# EAGLE design SparkFun_RFM22_SHield (EAGLE 7.2.0)
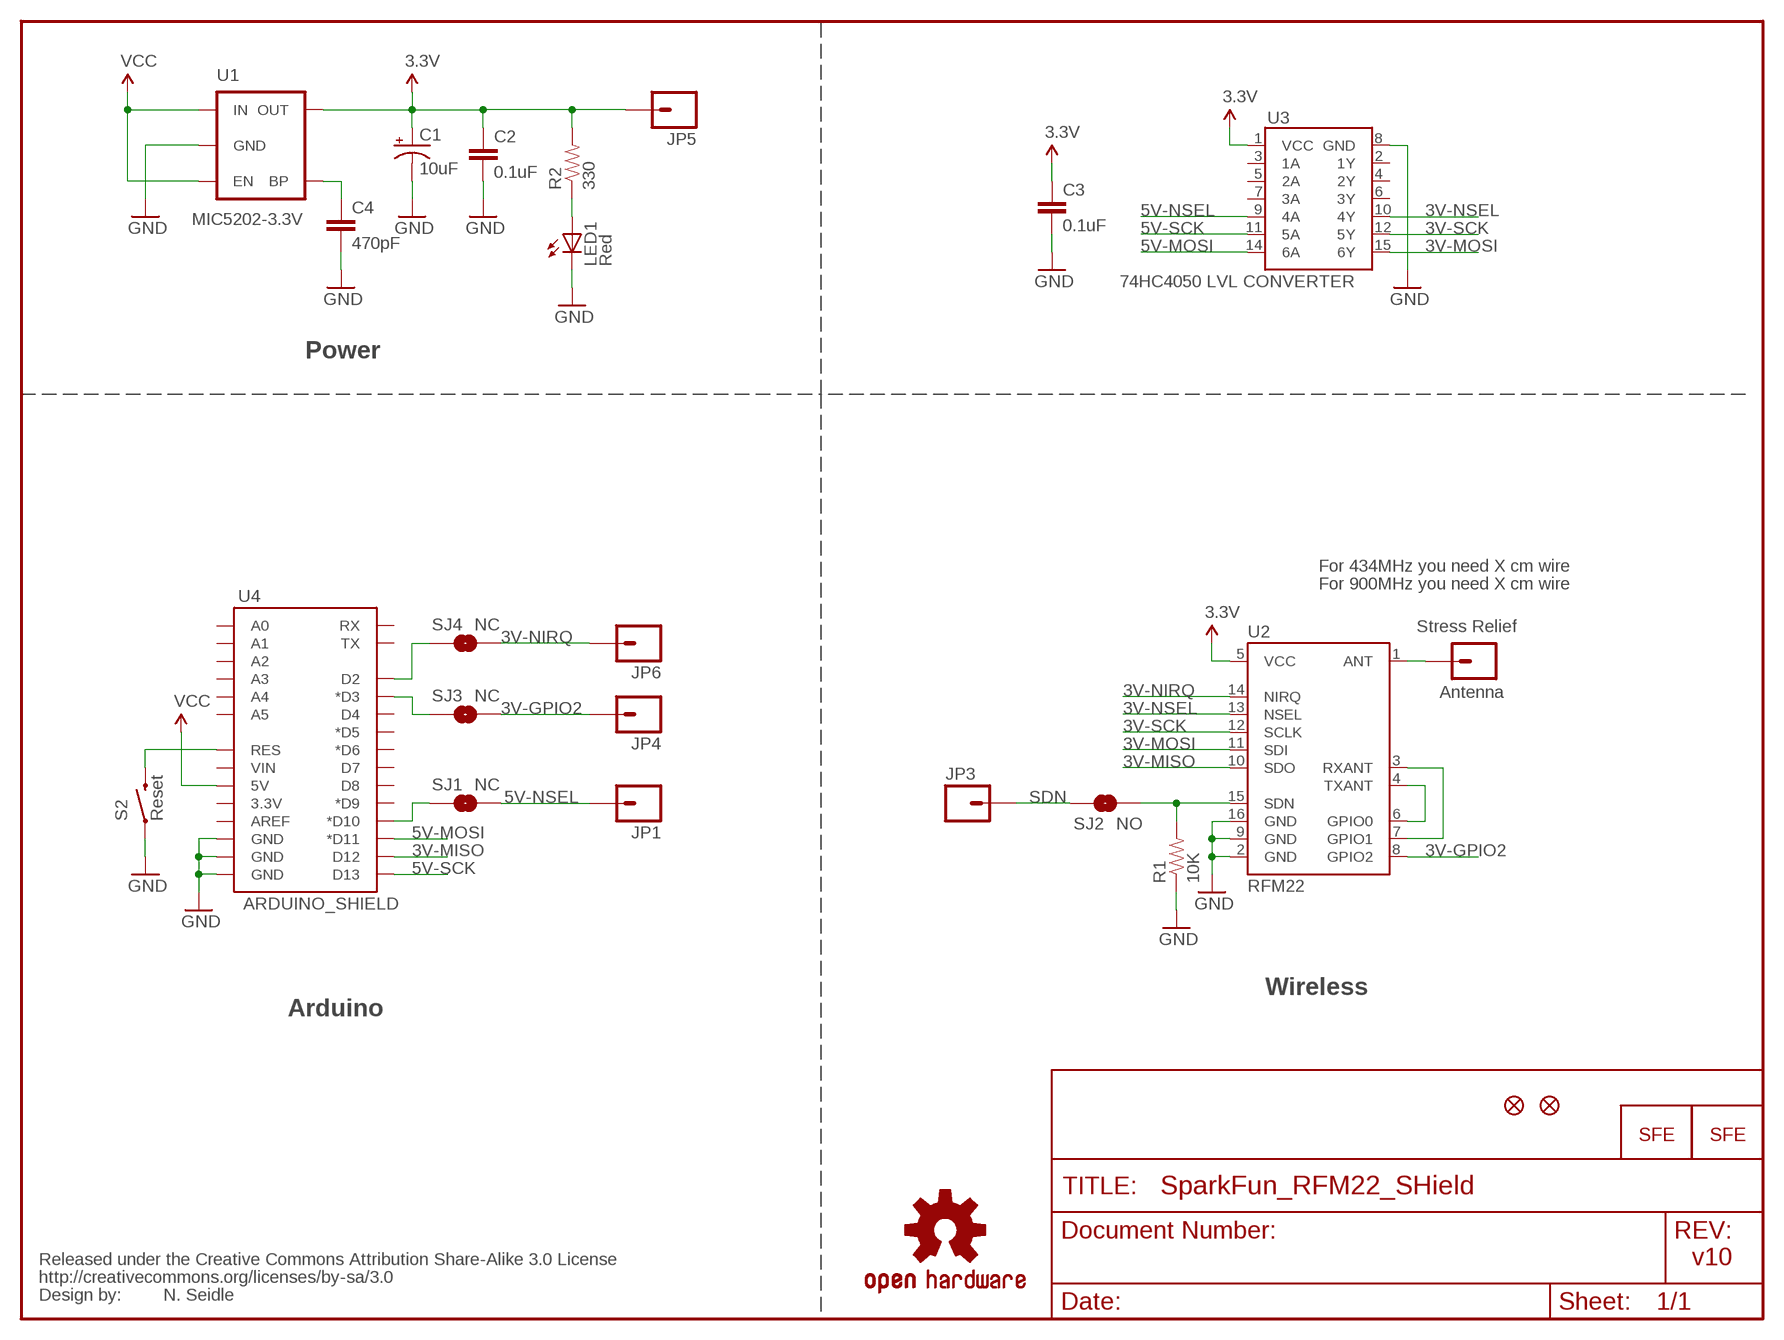
[diagram p0: schematic, sheet 1]

## Parts
C1  10uF  CAP_POL1206  [EIA3216]
C2  0.1uF  CAP0402-CAP  [0402-CAP]
C3  0.1uF  CAP0402-CAP  [0402-CAP]
C4  470pF  CAP0402-CAP  [0402-CAP]
JP1  M01PTH  [1X01]
JP2  Antenna  M01PTH  [1X01]
JP3  M01PTH  [1X01]
JP4  M01PTH  [1X01]
JP5  M01PTH  [1X01]
JP6  M01PTH  [1X01]
JP7  FIDUCIALUFIDUCIAL  [MICRO-FIDUCIAL]
JP8  FIDUCIALUFIDUCIAL  [MICRO-FIDUCIAL]
LED1  Red  LED0603  [LED-0603]
R1  10K  RESISTOR0402-RES  [0402-RES]
R2  330  RESISTOR0402-RES  [0402-RES]
S2  Reset  SWITCH-MOMENTARY-2SMD  [TACTILE_SWITCH_SMD]
SJ1  NC  SOLDERJUMPERTRACE  [SJ_2S-TRACE]
SJ2  NO  SOLDERJUMPERNO  [SJ_2S-NO]
SJ3  NC  SOLDERJUMPERTRACE  [SJ_2S-TRACE]
SJ4  NC  SOLDERJUMPERTRACE  [SJ_2S-TRACE]
U1  MIC5202-3.3V  V_REG_LDOSMD  [SOT23-5]
U2  RFM22  RFM22SMD  [RFM22-XXX-S2]
U3  74HC4050 LVL CONVERTER  HEX_CONVERTER  [SO016]
U4  ARDUINO_SHIELD  ARDUINO_SHIELDNOHOLES  [DUEMILANOVE_SHIELD_NOHOLES]
U$1  OSHW-LOGOS  [OSHW-LOGO-S]
U$3  CREATIVE_COMMONS  [CREATIVE_COMMONS]
U$7  LOGO-SFENEW  [SFE-NEW-WEBLOGO]
U$8  LOGO-SFENEW  [SFE-NEW-WEBLOGO]

## Nets
3.3V: C1.A(+) C2.1 C3.1 JP5.1 R2.2 U1.5(OUT) U2.5(VCC) U3.1(VCC)
3V-GPIO2: JP4.1 SJ3.2 U2.8(GPIO2)
3V-MISO: U2.10(SDO) U4.D12
3V-MOSI: U2.11(SDI) U3.15(6Y)
3V-NIRQ: JP6.1 SJ4.2 U2.14(NIRQ)
3V-NSEL: U2.13(NSEL) U3.10(4Y)
3V-SCK: U2.12(SCLK) U3.12(5Y)
5V-MOSI: U3.14(6A) U4.D11(*D11)
5V-NSEL: JP1.1 SJ1.2 U3.9(4A)
5V-SCK: U3.11(5A) U4.D13
ARST: S2.3 U4.RES
GND: C1.C(-) C2.2 C3.2 C4.2 LED1.C R1.1 S2.1 U1.2(GND) U2.2(GND) U2.9(GND) U2.16(GND) U3.8(GND) U4.GND@0(GND) U4.GND@1(GND) U4.GND@2(GND)
N$1: JP2.1 U2.1(ANT)
N$2: SJ1.1 U4.D10(*D10)
N$3: U2.4(TXANT) U2.6(GPIO0)
N$4: U2.3(RXANT) U2.7(GPIO1)
N$5: SJ3.1 U4.D3(*D3)
N$6: LED1.A R2.1
N$17: SJ4.1 U4.D2
N$70: C4.1 U1.4(BP)
SDN: JP3.1 SJ2.1
SDN2: R1.2 SJ2.2 U2.15(SDN)
VCC: U1.1(IN) U1.3(EN) U4.5V
Unconnected: U3.2(1Y) U3.3(1A) U3.4(2Y) U3.5(2A) U3.6(3Y) U3.7(3A) U4.3.3V U4.A0 U4.A1 U4.A2 U4.A3 U4.A4 U4.A5 U4.AREF U4.D4 U4.D5(*D5) U4.D6(*D6) U4.D7 U4.D8 U4.D9(*D9) U4.RX U4.TX U4.VIN

## Notes on the sheet
- Power
- For 434MHz you need X cm wire
- For 900MHz you need X cm wire
- Stress Relief
- Wireless
- Arduino
- v10
- N. Seidle

## Library data of the parts
C1 = SparkFun:CAP_POL: Capacitor Polarized These are standard SMD and PTH capacitors. Normally 10uF, 47uF, and 100uF in electrolytic and tantalum varieties. Always verify the external diameter of the through hole cap, it varies with capacity, voltage, and manufacturer. The EIA devices should be standard.
C2-C4 = SparkFun:CAP: Capacitor Standard 0603 ceramic capacitor, and 0.1" leaded capacitor.
JP1-JP6 = SparkFun:M01: Header 1 Standard 1-pin 0.1" header. Use with straight break away headers (SKU : PRT-00116), right angle break away headers (PRT-00553), swiss pins (PRT-00743), machine pins (PRT-00117), and female headers (PRT-00115).
JP7 JP8 = SparkFun:FIDUCIAL: Fiducial Alignment Points Various fiducial points for machine vision alignment.
LED1 = SparkFun:LED: LEDs Standard schematic elements and footprints for 5mm, 3mm, 1206, and 0603 sized LEDs. 5mm - Spark Fun Electronics SKU : COM-00529 (and others)
R1 R2 = SparkFun:RESISTOR: Resistor Basic schematic elements and footprints for 0603, 1206, and PTH resistors.
S2 = SparkFun:SWITCH-MOMENTARY-2
SJ1-SJ4 = SparkFun:SOLDERJUMPER: Solder Jumper Standard SMD solder jumper. Used to automate production. Two varients : Normally Open and Normally Closed are the same, but have different paste layers. NC will have a large amount of paste and should jumper during reflow.
U1 = SparkFun:V_REG_LDO: Voltage Regulator LDO Standard 150mA LDO voltage regulator in SOT-23 layout. Micrel part MIC5205. BP (by-pass) pin is used to lower output noise with 470pF cap.
U2 = SparkFun:RFM22: Description: The RFM22 is a low-power, low cost radio that is capable of operating in the 434MHz and 900MHz open bands. It's frequency is software defined and there are some very good libraries written for it.
U3 = SparkFun:HEX_CONVERTER
U4 = SparkFun:ARDUINO_SHIELD
U$1 = SparkFun:OSHW-LOGO: Open Source Hardware Logo This logo indicates the piece of hardware it is found on incorporates a OSHW license and/or adheres to the definition of open source hardware found here: http://freedomdefined.org/OSHW
U$3 = SparkFun:CREATIVE_COMMONS
U$7 U$8 = SparkFun:LOGO-SFE: Spark Fun Electronics PCB Logo This is the standard Spark Fun Electronics PCB logo.

## Board
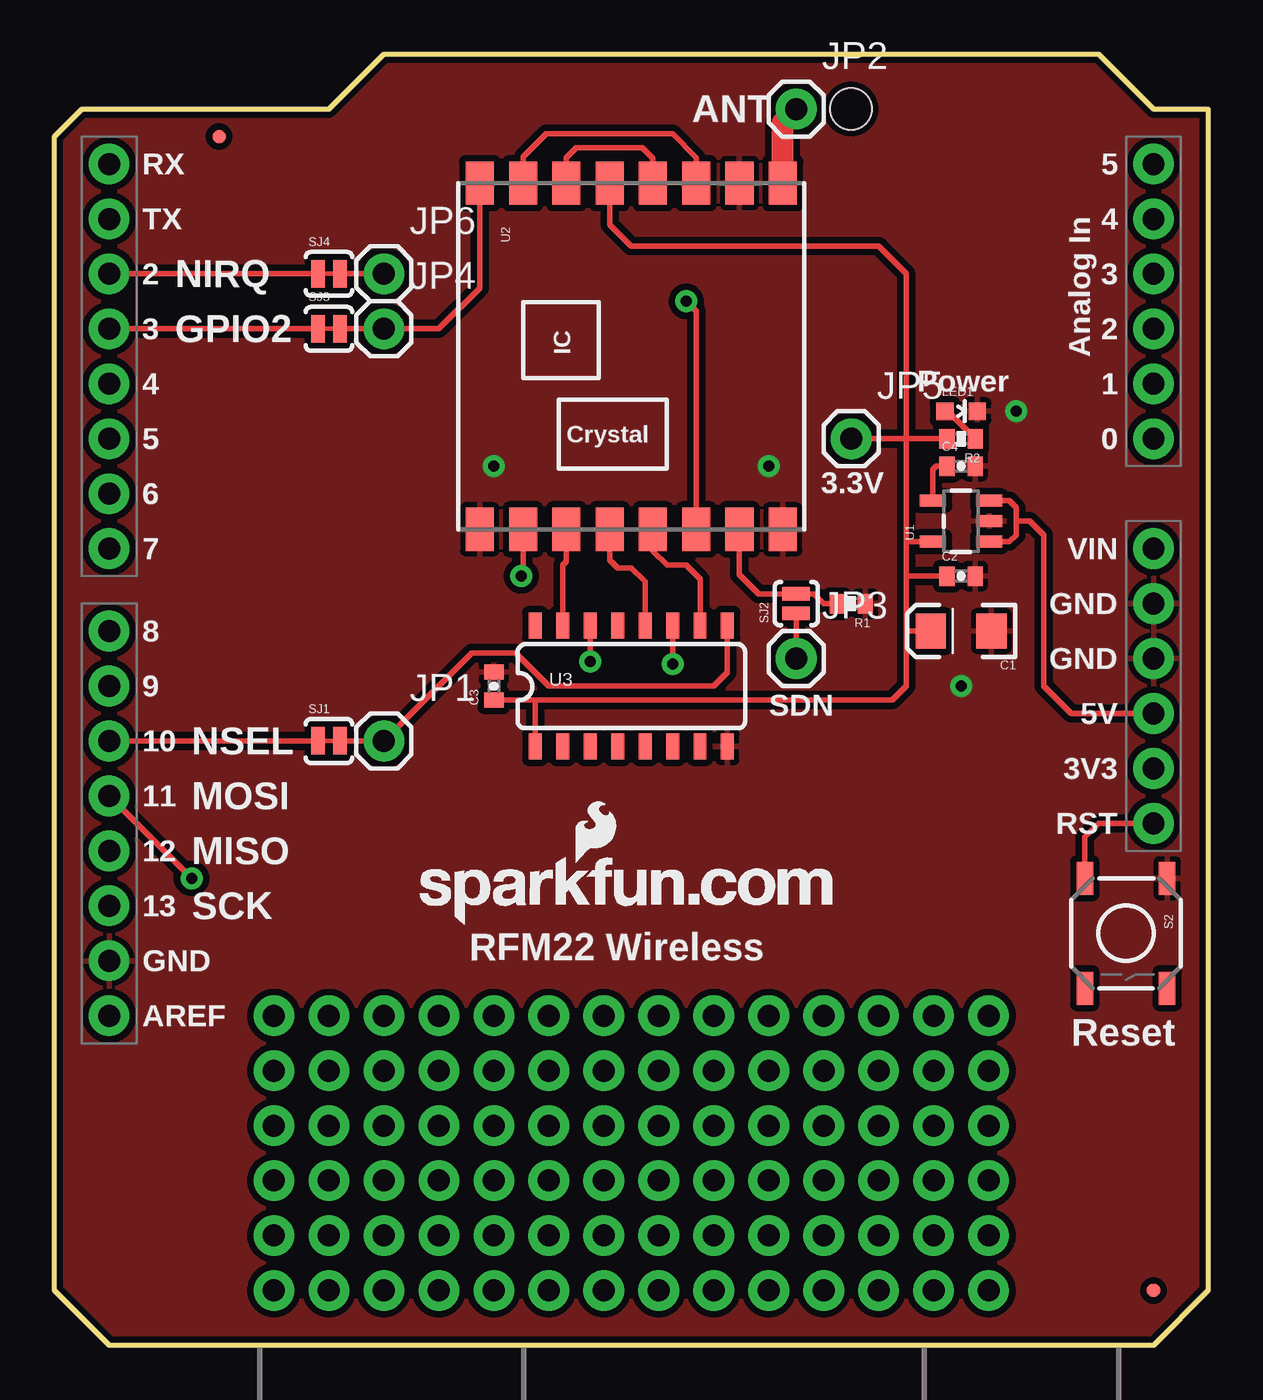
[diagram p1: board, top side]
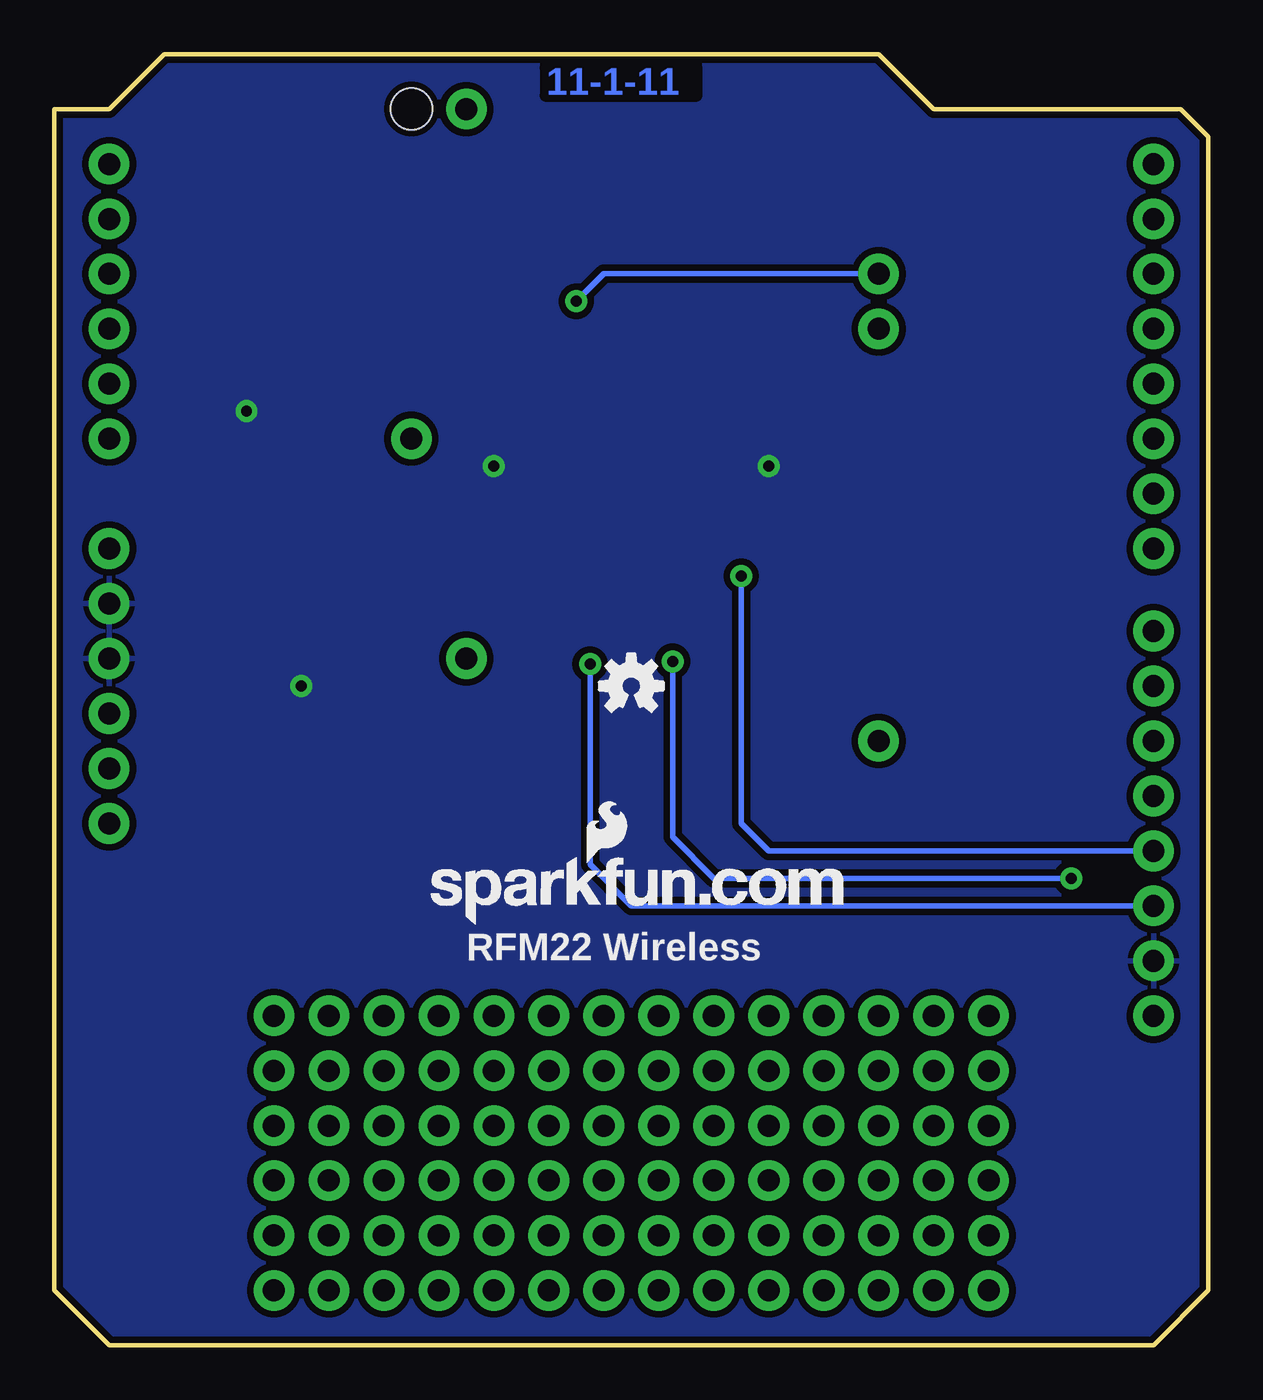
[diagram p2: board, bottom side, seen from below]

Size 53.34 x 59.69 mm. Coordinates in mm from the lower left corner, seen from the top.
Outline: 0,55.88 1.27,57.15 12.7,57.15 15.24,59.69 48.26,59.69 50.8,57.15 53.34,57.15 53.34,2.54 50.8,0 2.54,0 0,2.54 0,55.88
Copper layers (1*16): Top 0.035mm / dielectric 1.5mm / Bottom 0.035mm
Design rules "default": minimum track width 8mil, minimum drill 20mil, track to track 8mil, track to pad 8mil, pad to pad 8mil, via to via 8mil, smd to smd 8mil, copper to edge 10mil, drill to drill 8mil, minimum pad ring 12mil, minimum via ring 10mil, stop-mask expansion 4mil, vias tented up to drill 20mil, thermal gap 10mil
Holes 1.91 mm at 36.83,57.15

### Footprints (pad centres in the part's own frame; a part is rotated, then mirrored left to right if it is on the bottom)
EIA3216 = smd 1.4 x 1.6: A 1.4,0; C -1.4,0
0402-CAP = smd 0.7 x 0.9: 1 -0.65,0; 2 0.65,0
1X01 = drill 1.016 pad 1.88: 1 0,0
MICRO-FIDUCIAL = smd 0.635 x 0.635: 1 0,0
LED-0603 = smd 0.8 x 0.8: A 0,-0.75; C 0,0.75
0402-RES = smd 0.7 x 0.9: 1 -0.65,0; 2 0.65,0
TACTILE_SWITCH_SMD = smd 1.524 x 0.762: 1 -2.54,1.905; 2 2.54,1.905; 3 -2.54,-1.905; 4 2.54,-1.905
SJ_2S-TRACE = smd 0.635 x 1.27: 1 -0.508,0; 2 0.508,0
SJ_2S-NO = smd 0.635 x 1.27: 1 -0.45,0; 2 0.45,0
SOT23-5 = smd 0.55 x 1.2: 1 -0.95,-1.3; 2 0,-1.3; 3 0.95,-1.3; 4 0.95,1.3; 5 -0.95,1.3
RFM22-XXX-S2 = smd 2 x 1.3: 1 -8,7; 2 -8,5; 3 -8,3; 4 -8,1; 5 -8,-1; 6 -8,-3; 7 -8,-5; 8 -8,-7; 9 8,-7; 10 8,-5; 11 8,-3; 12 8,-1; 13 8,1; 14 8,3; 15 8,5; 16 8,7
SO016 = smd 0.6 x 1.2: 1 -4.445,-2.8; 2 -3.175,-2.8; 3 -1.905,-2.8; 4 -0.635,-2.8; 5 0.635,-2.8; 6 1.905,-2.8; 7 3.175,-2.8; 8 4.445,-2.8; 9 4.445,2.8; 10 3.175,2.8; 11 1.905,2.8; 12 0.635,2.8; 13 -0.635,2.8; 14 -1.905,2.8; 15 -3.175,2.8; 16 -4.445,2.8
DUEMILANOVE_SHIELD_NOHOLES = drill 1.016 pad 1.88: 3.3V 50.8,26.67; 5V 50.8,29.21; A0 50.8,41.91; A1 50.8,44.45; A2 50.8,46.99; A3 50.8,49.53; A4 50.8,52.07; A5 50.8,54.61; AREF 2.54,15.24; D2 2.54,49.53; D3 2.54,46.99; D4 2.54,44.45; D5 2.54,41.91; D6 2.54,39.37; D7 2.54,36.83; D8 2.54,33.02; D9 2.54,30.48; D10 2.54,27.94; D11 2.54,25.4; D12 2.54,22.86; D13 2.54,20.32; GND@0 50.8,31.75; GND@1 50.8,34.29; GND@2 2.54,17.78; RES 50.8,24.13; RX 2.54,54.61; TX 2.54,52.07; VIN 50.8,36.83

### Placement (x,y rotation side)
C1  41.91,33.02 180 top
C2  41.91,35.56 0 top
C3  20.32,30.48 90 top
C4  41.91,40.64 0 top
JP1  15.24,27.94 0 top
JP2  34.29,57.15 0 top
JP3  34.29,31.75 0 top
JP4  15.24,46.99 0 top
JP5  36.83,41.91 0 top
JP6  15.24,49.53 0 top
JP7  50.8,2.54 0 top
JP8  7.62,55.88 0 top
LED1  41.91,43.18 270 top
R1  36.83,34.29 180 top
R2  41.91,41.91 180 top
S2  49.53,19.05 270 top
SJ1  12.7,27.94 0 top
SJ2  34.29,34.29 90 top
SJ3  12.7,46.99 0 top
SJ4  12.7,49.53 0 top
U1  41.91,38.1 90 top
U2  26.67,45.72 270 top
U3  26.67,30.48 0 top
U4  0,0 0 top
U$1  26.67,30.48 0 bottom
U$3  -19.05,-11.43 0 top  (outside the outline)
U$7  16.89,19.43 0 top
U$8  35.94,19.43 0 bottom

### Tracks (layer width: path | path; a pad name or v marks a point on that pad's centre or on a via)
3.3V
  Top 0.254: 39.37,33.02 39.37,35.56 | 39.37,35.56 39.37,37.21 | 39.37,33.02 C1.A | 39.37,35.56 C2.1 | U1.5 39.43,37.15 39.37,37.21 | 22.23,29.83 C3.1 | 22.23,29.83 38.72,29.83 39.37,30.48 39.37,33.02 | U3.1 22.23,29.83 | U2.5 25.67,51.8 26.67,50.8 38.1,50.8 39.37,49.53 39.37,41.91 | 39.37,37.21 39.37,41.91 | 39.37,41.91 R2.2 | 39.37,41.91 JP5.1
3V-GPIO2
  Top 0.254: U2.8 19.67,48.88 17.78,46.99 JP4.1 SJ3.2
3V-MISO  (via drill 0.51)
  Top 0.254: U2.10 21.67,35.64 v21.59,35.56
  Bottom 0.254: U4.D12 20.32,22.86 21.59,24.13 v21.59,35.56
3V-MOSI
  Top 0.254: U3.15 23.5,36.07 23.67,36.24 U2.11
3V-NIRQ  (via drill 0.51)
  Top 0.254: U2.14 29.67,47.8 v29.21,48.26 | SJ4.2 JP6.1
  Bottom 0.254: v29.21,48.26 27.94,49.53 JP6.1
3V-NSEL
  Top 0.254: U2.13 27.67,36.72 28.32,36.07 29.21,36.07 29.84,35.43 U3.10
3V-SCK
  Top 0.254: U2.12 25.67,36.31 26.04,35.94 26.67,35.94 27.3,35.31 U3.12
5V-MOSI  (via drill 0.51)
  Top 0.254: v24.77,31.62 U3.14 | v6.35,21.59 U4.D11
  Bottom 0.254: v24.77,31.62 24.77,23.5 22.86,21.59 v6.35,21.59
5V-NSEL
  Top 0.254: SJ1.2 JP1.1 19.3,32 21.34,32 22.86,30.48 30.48,30.48 31.11,31.11 U3.9
5V-SCK  (via drill 0.51)
  Top 0.254: v28.57,31.5 U3.11
  Bottom 0.254: U4.D13 26.67,20.32 28.57,22.23 v28.57,31.5
ARST
  Top 0.254: S2.3 47.62,23.5 48.26,24.13 U4.RES
GND  (via drill 0.51 pad 1.02)
  other vias: 20.32,40.64 33.02,40.64 41.91,30.48 44.45,43.18
  pour Top (isolate 0.305): 0,59.69 53.34,59.69 53.34,0 0,0
  pour Bottom (isolate 0.305): 0,0 0,59.69 53.34,59.69 53.34,0
N$1
  Top 1.016: U2.1 33.67,56.53 JP2.1
N$2
  Top 0.254: U4.D10 SJ1.1
N$3
  Top 0.254: U2.4 27.67,54.88 27.18,55.37 24.13,55.37 23.67,54.91 U2.6
N$4
  Top 0.254: U2.3 29.67,54.91 28.57,56.01 22.73,56.01 21.67,54.94 U2.7
N$5
  Top 0.254: U4.D3 SJ3.1
N$6
  Top 0.254: LED1.A 41.29,43.18 R2.1
N$7  (via drill 1.02 pad 1.88)
  other vias: 10.16,2.54
N$8  (via drill 1.02 pad 1.88)
  other vias: 10.16,5.08
N$9  (via drill 1.02 pad 1.88)
  other vias: 10.16,7.62
N$10  (via drill 1.02 pad 1.88)
  other vias: 12.7,2.54
N$11  (via drill 1.02 pad 1.88)
  other vias: 12.7,5.08
N$12  (via drill 1.02 pad 1.88)
  other vias: 12.7,7.62
N$13  (via drill 1.02 pad 1.88)
  other vias: 12.7,10.16
N$14  (via drill 1.02 pad 1.88)
  other vias: 10.16,10.16
N$15  (via drill 1.02 pad 1.88)
  other vias: 10.16,12.7
N$16  (via drill 1.02 pad 1.88)
  other vias: 10.16,15.24
N$17
  Top 0.254: U4.D2 SJ4.1
N$18  (via drill 1.02 pad 1.88)
  other vias: 12.7,12.7
N$19  (via drill 1.02 pad 1.88)
  other vias: 12.7,15.24
N$23  (via drill 1.02 pad 1.88)
  other vias: 15.24,2.54
N$24  (via drill 1.02 pad 1.88)
  other vias: 15.24,5.08
N$25  (via drill 1.02 pad 1.88)
  other vias: 15.24,7.62
N$26  (via drill 1.02 pad 1.88)
  other vias: 17.78,2.54
N$27  (via drill 1.02 pad 1.88)
  other vias: 17.78,5.08
N$28  (via drill 1.02 pad 1.88)
  other vias: 17.78,7.62
N$29  (via drill 1.02 pad 1.88)
  other vias: 17.78,10.16
N$30  (via drill 1.02 pad 1.88)
  other vias: 15.24,10.16
N$31  (via drill 1.02 pad 1.88)
  other vias: 20.32,2.54
N$32  (via drill 1.02 pad 1.88)
  other vias: 20.32,5.08
N$33  (via drill 1.02 pad 1.88)
  other vias: 20.32,7.62
N$34  (via drill 1.02 pad 1.88)
  other vias: 22.86,2.54
N$35  (via drill 1.02 pad 1.88)
  other vias: 22.86,5.08
N$36  (via drill 1.02 pad 1.88)
  other vias: 22.86,7.62
N$37  (via drill 1.02 pad 1.88)
  other vias: 22.86,10.16
N$38  (via drill 1.02 pad 1.88)
  other vias: 20.32,10.16
N$39  (via drill 1.02 pad 1.88)
  other vias: 25.4,2.54
N$40  (via drill 1.02 pad 1.88)
  other vias: 25.4,5.08
N$41  (via drill 1.02 pad 1.88)
  other vias: 25.4,7.62
N$42  (via drill 1.02 pad 1.88)
  other vias: 27.94,2.54
N$43  (via drill 1.02 pad 1.88)
  other vias: 27.94,5.08
N$44  (via drill 1.02 pad 1.88)
  other vias: 27.94,7.62
N$45  (via drill 1.02 pad 1.88)
  other vias: 27.94,10.16
N$46  (via drill 1.02 pad 1.88)
  other vias: 25.4,10.16
N$47  (via drill 1.02 pad 1.88)
  other vias: 30.48,2.54
N$48  (via drill 1.02 pad 1.88)
  other vias: 30.48,5.08
N$49  (via drill 1.02 pad 1.88)
  other vias: 30.48,7.62
N$50  (via drill 1.02 pad 1.88)
  other vias: 33.02,2.54
N$51  (via drill 1.02 pad 1.88)
  other vias: 33.02,5.08
N$52  (via drill 1.02 pad 1.88)
  other vias: 33.02,7.62
N$53  (via drill 1.02 pad 1.88)
  other vias: 33.02,10.16
N$54  (via drill 1.02 pad 1.88)
  other vias: 30.48,10.16
N$55  (via drill 1.02 pad 1.88)
  other vias: 35.56,2.54
N$56  (via drill 1.02 pad 1.88)
  other vias: 35.56,5.08
N$57  (via drill 1.02 pad 1.88)
  other vias: 35.56,7.62
N$58  (via drill 1.02 pad 1.88)
  other vias: 38.1,2.54
N$59  (via drill 1.02 pad 1.88)
  other vias: 38.1,5.08
N$60  (via drill 1.02 pad 1.88)
  other vias: 38.1,7.62
N$61  (via drill 1.02 pad 1.88)
  other vias: 38.1,10.16
N$62  (via drill 1.02 pad 1.88)
  other vias: 35.56,10.16
N$63  (via drill 1.02 pad 1.88)
  other vias: 40.64,2.54
N$64  (via drill 1.02 pad 1.88)
  other vias: 40.64,5.08
N$65  (via drill 1.02 pad 1.88)
  other vias: 40.64,7.62
N$66  (via drill 1.02 pad 1.88)
  other vias: 43.18,2.54
N$67  (via drill 1.02 pad 1.88)
  other vias: 43.18,5.08
N$68  (via drill 1.02 pad 1.88)
  other vias: 43.18,7.62
N$69  (via drill 1.02 pad 1.88)
  other vias: 43.18,10.16
N$70
  Top 0.254: U1.4 40.61,40.48 40.77,40.64 C4.1
N$71  (via drill 1.02 pad 1.88)
  other vias: 40.64,10.16
N$88  (via drill 1.02 pad 1.88)
  other vias: 15.24,12.7
N$89  (via drill 1.02 pad 1.88)
  other vias: 15.24,15.24
N$91  (via drill 1.02 pad 1.88)
  other vias: 17.78,12.7
N$92  (via drill 1.02 pad 1.88)
  other vias: 17.78,15.24
N$96  (via drill 1.02 pad 1.88)
  other vias: 20.32,12.7
N$97  (via drill 1.02 pad 1.88)
  other vias: 20.32,15.24
N$99  (via drill 1.02 pad 1.88)
  other vias: 22.86,12.7
N$100  (via drill 1.02 pad 1.88)
  other vias: 22.86,15.24
N$104  (via drill 1.02 pad 1.88)
  other vias: 25.4,12.7
N$105  (via drill 1.02 pad 1.88)
  other vias: 25.4,15.24
N$107  (via drill 1.02 pad 1.88)
  other vias: 27.94,12.7
N$108  (via drill 1.02 pad 1.88)
  other vias: 27.94,15.24
N$112  (via drill 1.02 pad 1.88)
  other vias: 30.48,12.7
N$113  (via drill 1.02 pad 1.88)
  other vias: 30.48,15.24
N$115  (via drill 1.02 pad 1.88)
  other vias: 33.02,12.7
N$116  (via drill 1.02 pad 1.88)
  other vias: 33.02,15.24
N$120  (via drill 1.02 pad 1.88)
  other vias: 35.56,12.7
N$121  (via drill 1.02 pad 1.88)
  other vias: 35.56,15.24
N$123  (via drill 1.02 pad 1.88)
  other vias: 38.1,12.7
N$124  (via drill 1.02 pad 1.88)
  other vias: 38.1,15.24
N$128  (via drill 1.02 pad 1.88)
  other vias: 40.64,12.7
N$129  (via drill 1.02 pad 1.88)
  other vias: 40.64,15.24
N$131  (via drill 1.02 pad 1.88)
  other vias: 43.18,12.7
N$132  (via drill 1.02 pad 1.88)
  other vias: 43.18,15.24
SDN
  Top 0.254: JP3.1 SJ2.1
SDN2
  Top 0.254: U2.15 31.67,35.64 32.57,34.74 SJ2.2 35.11,34.74 35.56,34.29 R1.2
VCC
  Top 0.254: U4.5V 46.99,29.21 45.72,30.48 45.72,37.47 45.09,38.1 44.45,38.1 | U1.3 44.13,39.05 44.45,38.73 44.45,38.1 | 44.45,38.1 44.45,37.47 44.13,37.15 U1.1

### Text on the board
Bottom: 11-1-11
tPlace: ANT | NIRQ | GPIO2 | Power | 3.3V | SDN | NSEL | MOSI | MISO | SCK | RFM22 Wireless | Reset | N. Seidle
bPlace: RFM22 Wireless